# EAGLE design SensorBoard_Mega (EAGLE 7.3.0)
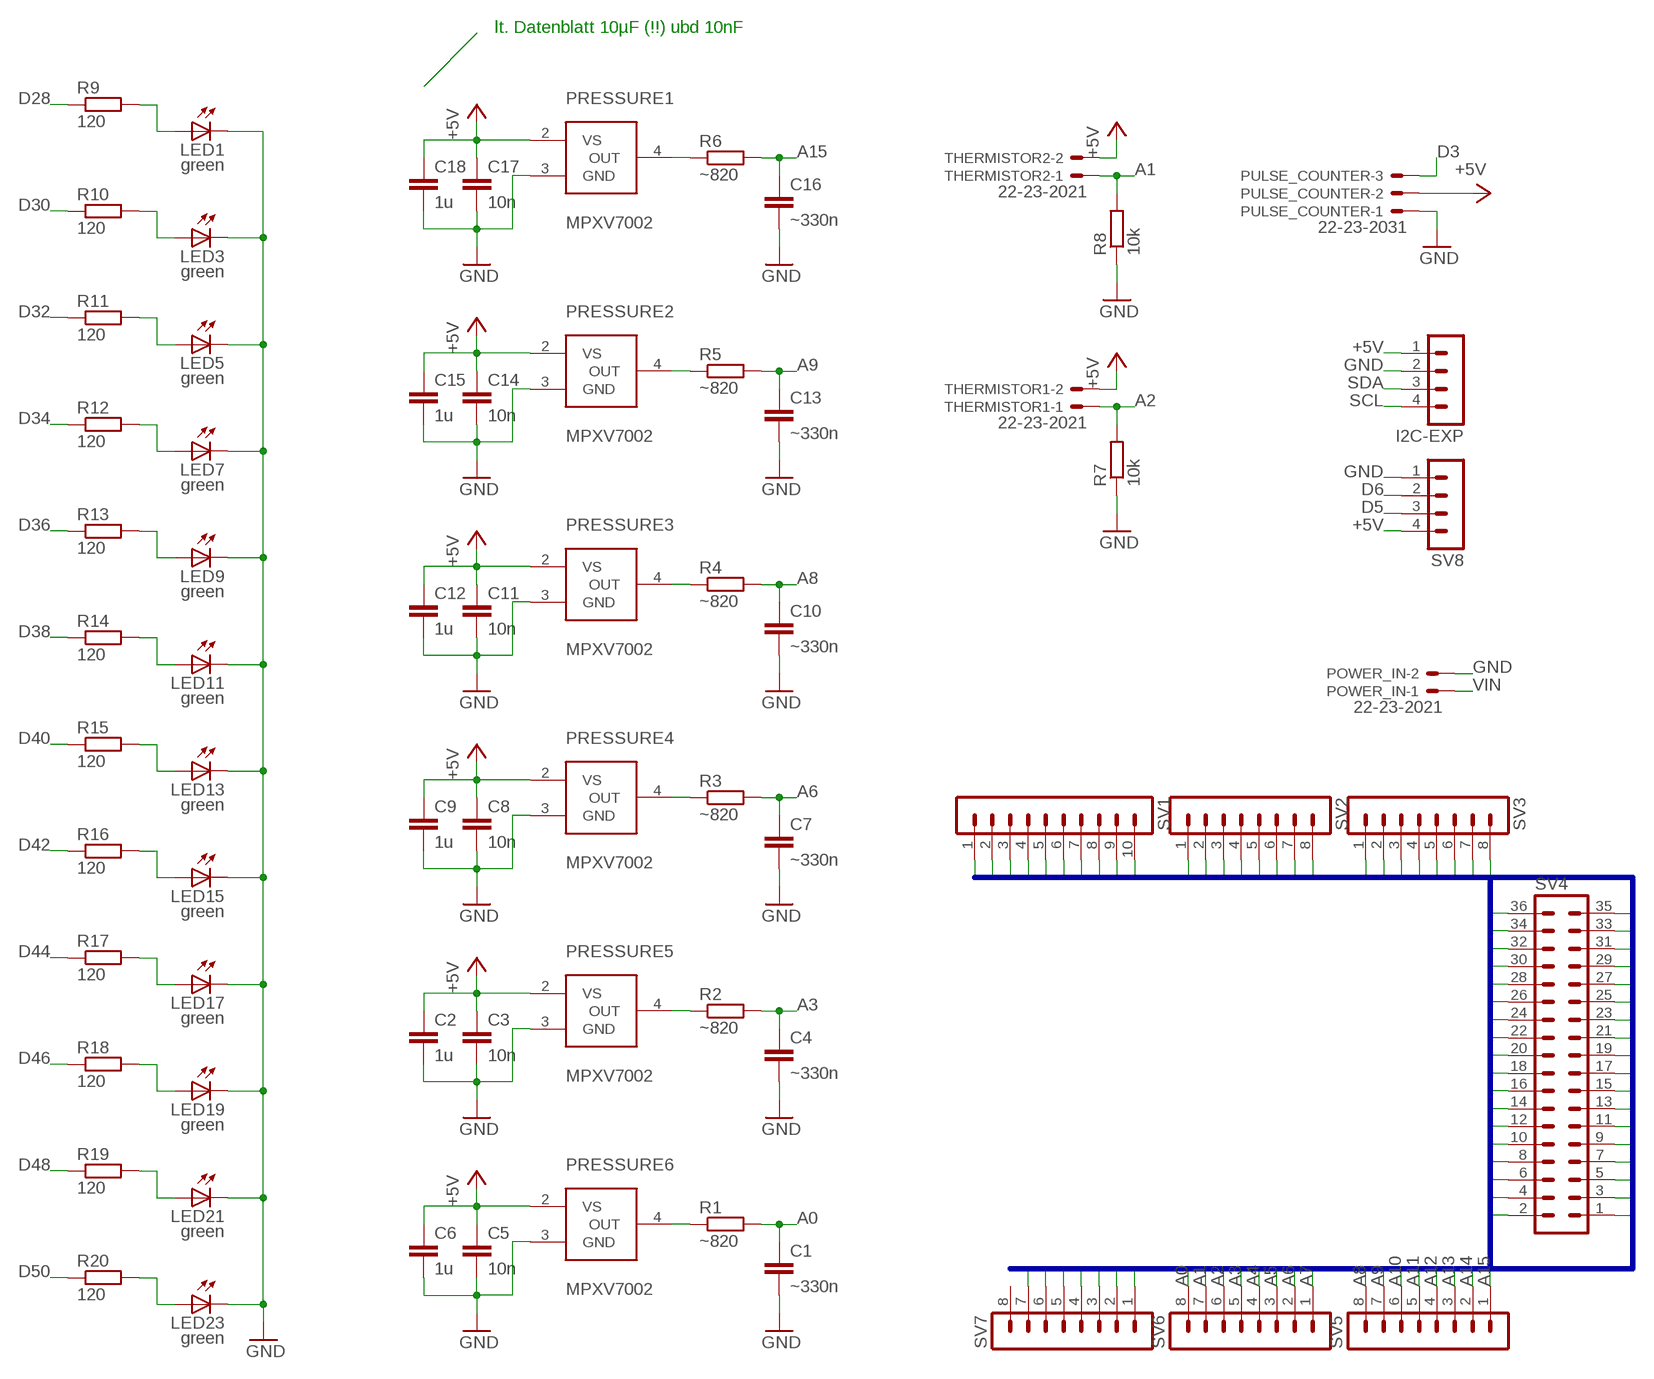
[diagram p0: schematic, sheet 1]

## Parts
C1  ~330n  C-EUC0805  [C0805]
C2  1u  C-EUC0805  [C0805]
C3  10n  C-EUC0805  [C0805]
C4  ~330n  C-EUC0805  [C0805]
C5  10n  C-EUC0805  [C0805]
C6  1u  C-EUC0805  [C0805]
C7  ~330n  C-EUC0805  [C0805]
C8  10n  C-EUC0805  [C0805]
C9  1u  C-EUC0805  [C0805]
C10  ~330n  C-EUC0805  [C0805]
C11  10n  C-EUC0805  [C0805]
C12  1u  C-EUC0805  [C0805]
C13  ~330n  C-EUC0805  [C0805]
C14  10n  C-EUC0805  [C0805]
C15  1u  C-EUC0805  [C0805]
C16  ~330n  C-EUC0805  [C0805]
C17  10n  C-EUC0805  [C0805]
C18  1u  C-EUC0805  [C0805]
I2C-EXP  MA04-1  [MA04-1]
LED1  green  LEDCHIPLED_0805  [CHIPLED_0805]
LED3  green  LEDCHIPLED_0805  [CHIPLED_0805]
LED5  green  LEDCHIPLED_0805  [CHIPLED_0805]
LED7  green  LEDCHIPLED_0805  [CHIPLED_0805]
LED9  green  LEDCHIPLED_0805  [CHIPLED_0805]
LED11  green  LEDCHIPLED_0805  [CHIPLED_0805]
LED13  green  LEDCHIPLED_0805  [CHIPLED_0805]
LED15  green  LEDCHIPLED_0805  [CHIPLED_0805]
LED17  green  LEDCHIPLED_0805  [CHIPLED_0805]
LED19  green  LEDCHIPLED_0805  [CHIPLED_0805]
LED21  green  LEDCHIPLED_0805  [CHIPLED_0805]
LED23  green  LEDCHIPLED_0805  [CHIPLED_0805]
POWER_IN  22-23-2021  [22-23-2021]
PRESSURE1  MPXV7002  [MPXV7002DP]
PRESSURE2  MPXV7002  [MPXV7002DP]
PRESSURE3  MPXV7002  [MPXV7002DP]
PRESSURE4  MPXV7002  [MPXV7002DP]
PRESSURE5  MPXV7002  [MPXV7002DP]
PRESSURE6  MPXV7002  [MPXV7002DP]
PULSE_COUNTER  22-23-2031  [22-23-2031]
R1  ~820  R-EU_R0805  [R0805]
R2  ~820  R-EU_R0805  [R0805]
R3  ~820  R-EU_R0805  [R0805]
R4  ~820  R-EU_R0805  [R0805]
R5  ~820  R-EU_R0805  [R0805]
R6  ~820  R-EU_R0805  [R0805]
R7  10k  R-EU_R0805  [R0805]
R8  10k  R-EU_R0805  [R0805]
R9  120  R-EU_R0805  [R0805]
R10  120  R-EU_R0805  [R0805]
R11  120  R-EU_R0805  [R0805]
R12  120  R-EU_R0805  [R0805]
R13  120  R-EU_R0805  [R0805]
R14  120  R-EU_R0805  [R0805]
R15  120  R-EU_R0805  [R0805]
R16  120  R-EU_R0805  [R0805]
R17  120  R-EU_R0805  [R0805]
R18  120  R-EU_R0805  [R0805]
R19  120  R-EU_R0805  [R0805]
R20  120  R-EU_R0805  [R0805]
SV1  MA10-1  [MA10-1]
SV2  MA08-1  [MA08-1]
SV3  MA08-1  [MA08-1]
SV4  MA18-2  [MA18-2]
SV5  MA08-1  [MA08-1]
SV6  MA08-1  [MA08-1]
SV7  MA08-1  [MA08-1]
SV8  MA04-1  [MA04-1]
THERMISTOR1  22-23-2021  [22-23-2021]
THERMISTOR2  22-23-2021  [22-23-2021]

## Nets
+3V3: SV7.5
+5V: C2.1 C3.1 C5.1 C6.1 C8.1 C9.1 C11.1 C12.1 C14.1 C15.1 C17.1 C18.1 I2C-EXP.1 PRESSURE1.2(VS) PRESSURE2.2(VS) PRESSURE3.2(VS) PRESSURE4.2(VS) PRESSURE5.2(VS) PRESSURE6.2(VS) PULSE_COUNTER.2 SV4.35 SV4.36 SV7.4 SV8.4 THERMISTOR1.2 THERMISTOR2.2
A0: C1.1 R1.2 SV6.8
A1: R8.2 SV6.7 THERMISTOR2.1
A2: R7.2 SV6.6 THERMISTOR1.1
A3: C4.1 R2.2 SV6.5
A4: SV6.4
A5: SV6.3
A6: C7.1 R3.2 SV6.2
A7: SV6.1
A8: C10.1 R4.2 SV5.8
A9: C13.1 R5.2 SV5.7
A10: SV5.6
A11: SV5.5
A12: SV5.4
A13: SV5.3
A14: SV5.2
A15: C16.1 R6.2 SV5.1
AREF: SV1.3
D0: SV2.8
D1: SV2.7
D2: SV2.6
D3: PULSE_COUNTER.3 SV2.5
D4: SV2.4
D5: SV2.3 SV8.3
D6: SV2.2 SV8.2
D7: SV2.1
D8: SV1.10
D9: SV1.9
D10: SV1.8
D11: SV1.7
D12: SV1.6
D13: SV1.5
D14: SV3.1
D15: SV3.2
D16: SV3.3
D17: SV3.4
D18: SV3.5
D19: SV3.6
D22: SV4.34
D23: SV4.33
D24: SV4.32
D25: SV4.31
D26: SV4.30
D27: SV4.29
D28: R9.1 SV4.28
D29: SV4.27
D30: R10.1 SV4.26
D31: SV4.25
D32: R11.1 SV4.24
D33: SV4.23
D34: R12.1 SV4.22
D35: SV4.21
D36: R13.1 SV4.20
D37: SV4.19
D38: R14.1 SV4.18
D39: SV4.17
D40: R15.1 SV4.16
D41: SV4.15
D42: R16.1 SV4.14
D43: SV4.13
D44: R17.1 SV4.12
D45: SV4.11
D46: R18.1 SV4.10
D47: SV4.9
D48: R19.1 SV4.8
D49: SV4.7
D50: R20.1 SV4.6
D51: SV4.5
D52: SV4.4
D53: SV4.3
GND: C1.2 C2.2 C3.2 C4.2 C5.2 C6.2 C7.2 C8.2 C9.2 C10.2 C11.2 C12.2 C13.2 C14.2 C15.2 C16.2 C17.2 C18.2 I2C-EXP.2 LED1.C LED3.C LED5.C LED7.C LED9.C LED11.C LED13.C LED15.C LED17.C LED19.C LED21.C LED23.C POWER_IN.2 PRESSURE1.3(GND) PRESSURE2.3(GND) PRESSURE3.3(GND) PRESSURE4.3(GND) PRESSURE5.3(GND) PRESSURE6.3(GND) PULSE_COUNTER.1 R7.1 R8.1 SV1.4 SV4.1 SV4.2 SV7.2 SV7.3 SV8.1
IOREF: SV7.7
N$1: LED1.A R9.2
N$3: PRESSURE6.4(OUT) R1.1
N$6: PRESSURE5.4(OUT) R2.1
N$7: PRESSURE4.4(OUT) R3.1
N$8: PRESSURE3.4(OUT) R4.1
N$9: PRESSURE2.4(OUT) R5.1
N$10: PRESSURE1.4(OUT) R6.1
N$13: LED3.A R10.2
N$16: LED5.A R11.2
N$19: LED7.A R12.2
N$22: LED9.A R13.2
N$25: LED11.A R14.2
N$28: LED13.A R15.2
N$31: LED15.A R16.2
N$34: LED17.A R17.2
N$37: LED19.A R18.2
N$40: LED21.A R19.2
N$43: LED23.A R20.2
RESET: SV7.6
SCL: I2C-EXP.4 SV1.2 SV3.8
SDA: I2C-EXP.3 SV1.1 SV3.7
VIN: POWER_IN.1 SV7.1
Unconnected: SV7.8

## Buses
D[0..53],A[0..15],SCL,SDA,AREF,GND,+5V,+3V3,VIN,RESET,IOREF

## Notes on the sheet
- lt. Datenblatt 10µF (!!) ubd 10nF

## Library data of the parts
C1-C18 = rcl:C-EU: CAPACITOR, European symbol
I2C-EXP SV8 = con-lstb:MA04-1: PIN HEADER; OC_FARNELL: unknown; OC_NEWARK: unknown
LED1 LED3 LED5 LED7 LED9 LED11 LED13 LED15 LED17 LED19 LED21 LED23 = led:LED: LED OSRAM: - CHIPLED LG R971, LG N971, LY N971, LG Q971, LY Q971, LO R971, LY R971 LH N974, LH R974 LS Q976, LO Q976, LY Q976 LO Q996 - Hyper CHIPLED LW Q18S LB Q993, LB Q99A, LB R99A - SideLED LS A670, LO A670, LY A670, LG A670, LP A670 LB A673, LV A673, LT A673, LW A673 LH A674 LY A675 LS A676, LA A676, LO A676, LY A676, LW A676 LS A679, LY A679, LG A679 - Hyper Micro SIDELED® LS Y876, LA Y876, LO Y876, LY Y876 LT Y87S - SmartLED LW L88C, LW L88S LB L89C, LB L89S, LG L890 LS L89K, LO L89K, LY L89K LS L896, LA L896, LO L896, LY L896 - TOPLED LS T670, LO T670, LY T670, LG T670, LP T670 LSG T670, LSP T670, LSY T670, LOP T670, LYG T670 LG T671, LOG T671, LSG T671 LB T673, LV T673, LT T673, LW T673 LH T674 LS T676, LA T676, LO T676, LY T676, LB T676, LH T676, LSB T676, LW T676 LB T67C, LV T67C, LT T67C, LS T67K, LO T67K, LY T67K, LW E67C LS E67B, LA E67B, LO E67B, LY E67B, LB E67C, LV E67C, LT E67C LW T67C LS T679, LY T679, LG T679 LS T770, LO T770, LY T770, LG T770, LP T770 LB T773, LV T773, LT T773, LW T773 LH T774 LS E675, LA E675, LY E675, LS T675 LS T776, LA T776, LO T776, LY T776, LB T776 LHGB T686 LT T68C, LB T68C - Hyper Mini TOPLED® LB M676 - Mini TOPLED Santana® LG M470 LS M47K, LO M47K, LY M47K Source: http://www.osram.convergy.de LUXEON: - LUMILED® LXK2-PW12-R00, LXK2-PW12-S00, LXK2-PW14-U00, LXK2-PW14-V00 LXK2-PM12-R00, LXK2-PM12-S00, LXK2-PM14-U00 LXK2-PE12-Q00, LXK2-PE12-R00, LXK2-PE12-S00, LXK2-PE14-T00, LXK2-PE14-U00 LXK2-PB12-K00, LXK2-PB12-L00, LXK2-PB12-M00, LXK2-PB14-N00, LXK2-PB14-P00, LXK2-PB14-Q00 LXK2-PR12-L00, LXK2-PR12-M00, LXK2-PR14-Q00, LXK2-PR14-R00 LXK2-PD12-Q00, LXK2-PD12-R00, LXK2-PD12-S00 LXK2-PH12-R00, LXK2-PH12-S00 LXK2-PL12-P00, LXK2-PL12-Q00, LXK2-PL12-R00 Source: www.luxeon.com KINGBRIGHT: KA-3528ASYC Source: www.kingbright.com
POWER_IN THERMISTOR1 THERMISTOR2 = con-molex:22-23-2021: .100" (2.54mm) Center Header - 2 Pin; MF: MOLEX; MPN: 22-23-2021; OC_FARNELL: 1462926; OC_NEWARK: 25C3832
PRESSURE1-PRESSURE6 = pcaroli:MPXV7002
PULSE_COUNTER = con-molex:22-23-2031: .100" (2.54mm) Center Header - 3 Pin; MF: MOLEX; MPN: 22-23-2031; OC_FARNELL: 1462950; OC_NEWARK: 30C0862
R1-R20 = rcl:R-EU_: RESISTOR, European symbol
SV1 = con-lstb-mod:MA10-1: PIN HEADER; OC_FARNELL: unknown; OC_NEWARK: unknown
SV2 SV3 SV5-SV7 = con-lstb-mod:MA08-1: PIN HEADER; OC_FARNELL: unknown; OC_NEWARK: unknown
SV4 = con-lstb-mod:MA18-2: PIN HEADER; OC_FARNELL: unknown; OC_NEWARK: unknown

## Net classes
0 default: clearance 0.205 mm

## Board
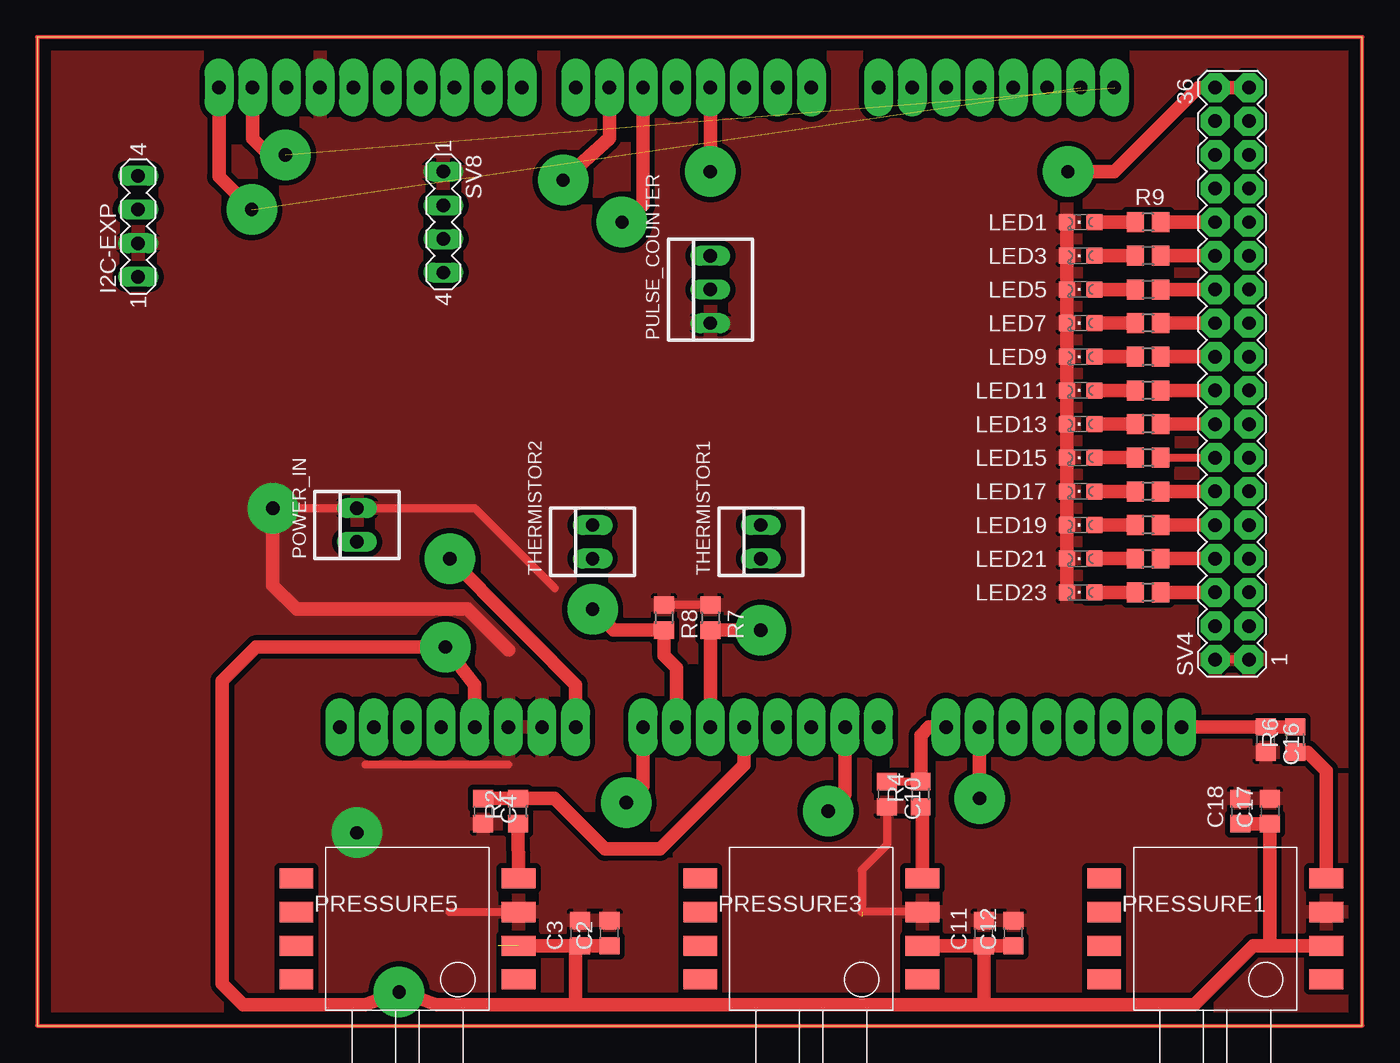
[diagram p1: board, top side]
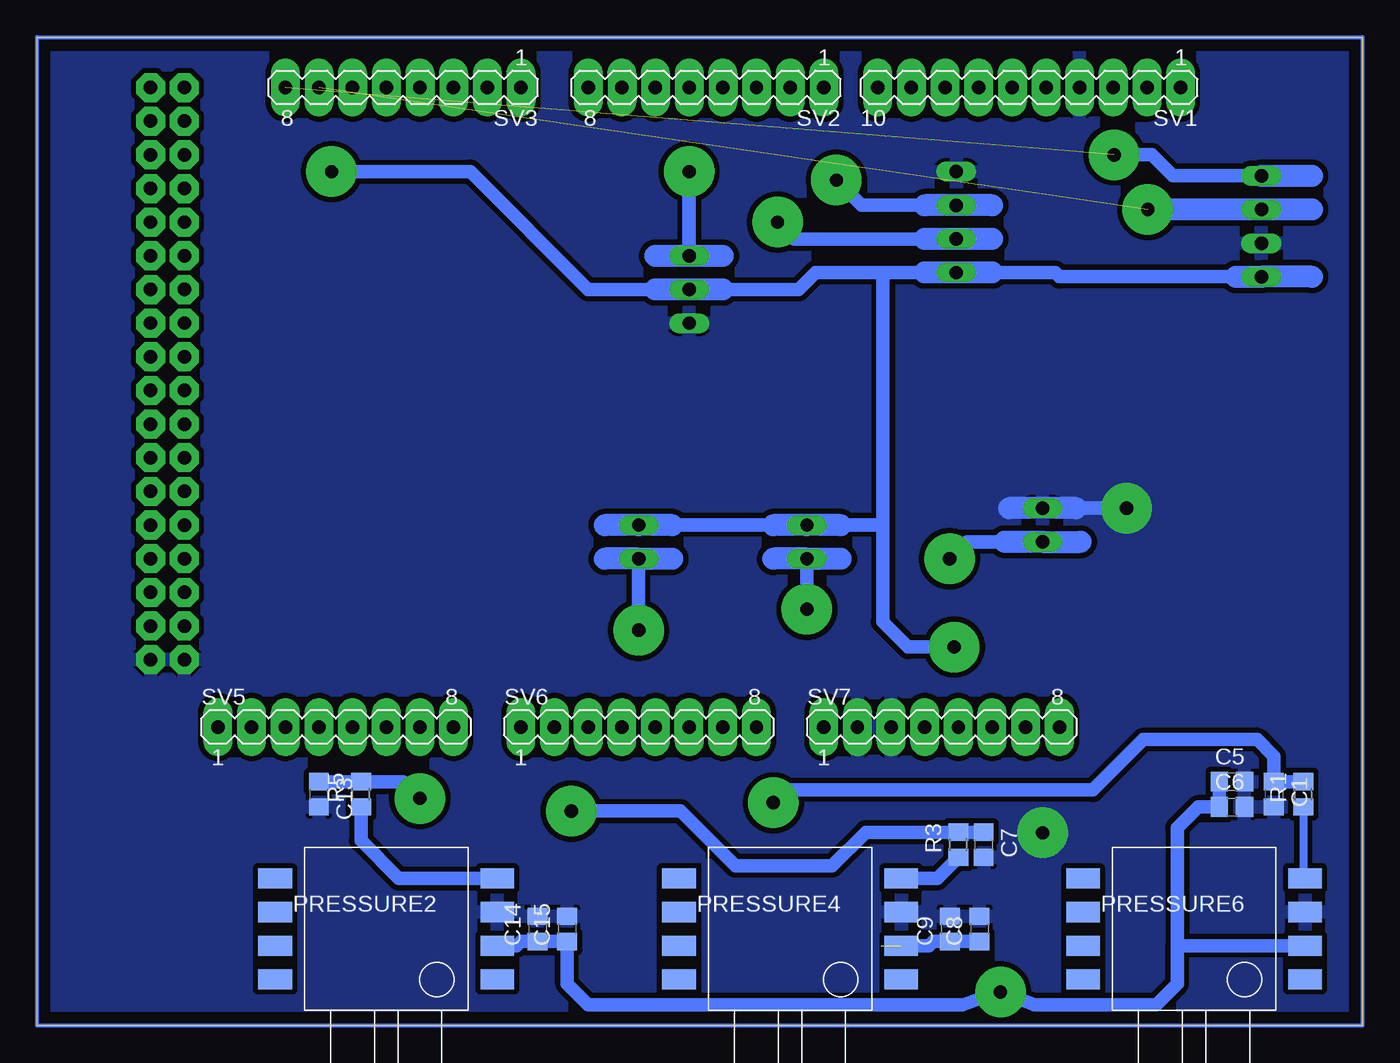
[diagram p2: board, bottom side, seen from below]

Size 100 x 74.6 mm. Coordinates in mm from the lower left corner, seen from the top.
Outline: 0,0 100,0 100,74.6 0,74.6 0,0
Copper layers (1*16): Top 0.035mm / dielectric 1.5mm / Bottom 0.035mm
Design rules "arduinoMega_ralf *": minimum track width 10mil, minimum drill 24mil, track to track 0.205mm, track to pad 0.205mm, pad to pad 0.205mm, via to via 0.205mm, smd to smd 8mil, copper to edge 40mil, drill to drill 8mil, minimum pad ring 10mil, minimum via ring 8mil, stop-mask expansion 4mil, vias tented up to drill 0mil, thermal gap 10mil

### Footprints (pad centres in the part's own frame; a part is rotated, then mirrored left to right if it is on the bottom)
C0805 = smd 1.3 x 1.5: 1 -0.95,0; 2 0.95,0
MA04-1 = drill 1.016 long: 1 -3.81,0; 2 -1.27,0; 3 1.27,0; 4 3.81,0
CHIPLED_0805 = smd 1.2 x 1.2: A 0,-1.05; C 0,1.05
22-23-2021 = drill 1 long: 1 -1.27,0; 2 1.27,0
MPXV7002DP = smd 2.54 x 1.524: 1 -8.382,3.81; 2 -8.382,1.27; 3 -8.382,-1.27; 4 -8.382,-3.81; 5 8.382,-3.81; 6 8.382,-1.27; 7 8.382,1.27; 8 8.382,3.81
22-23-2031 = drill 1 long: 1 -2.54,0; 2 0,0; 3 2.54,0
R0805 = smd 1.3 x 1.5: 1 -0.95,0; 2 0.95,0
MA10-1 = drill 1.016 pad 2.184 long: 1 -11.43,0; 2 -8.89,0; 3 -6.35,0; 4 -3.81,0; 5 -1.27,0; 6 1.27,0; 7 3.81,0; 8 6.35,0; 9 8.89,0; 10 11.43,0
MA08-1 = drill 1.016 pad 2.184 long: 1 -8.89,0; 2 -6.35,0; 3 -3.81,0; 4 -1.27,0; 5 1.27,0; 6 3.81,0; 7 6.35,0; 8 8.89,0
MA18-2 = drill 1.016 pad 2.184 octagon: 1 -21.59,-1.27; 2 -21.59,1.27; 3 -19.05,-1.27; 4 -19.05,1.27; 5 -16.51,-1.27; 6 -16.51,1.27; 7 -13.97,-1.27; 8 -13.97,1.27; 9 -11.43,-1.27; 10 -11.43,1.27; 11 -8.89,-1.27; 12 -8.89,1.27; 13 -6.35,-1.27; 14 -6.35,1.27; 15 -3.81,-1.27; 16 -3.81,1.27; 17 -1.27,-1.27; 18 -1.27,1.27; 19 1.27,-1.27; 20 1.27,1.27; 21 3.81,-1.27; 22 3.81,1.27; 23 6.35,-1.27; 24 6.35,1.27; 25 8.89,-1.27; 26 8.89,1.27; 27 11.43,-1.27; 28 11.43,1.27; 29 13.97,-1.27; 30 13.97,1.27; 31 16.51,-1.27; 32 16.51,1.27; 33 19.05,-1.27; 34 19.05,1.27; 35 21.59,-1.27; 36 21.59,1.27

### Placement (x,y rotation side)
C1  6.67,17.46 270 bottom
C2  43.18,6.99 90 top
C3  40.96,6.99 90 top
C4  33.66,16.19 270 top
C5  9.84,18.41 0 bottom
C6  9.84,16.51 0 bottom
C7  28.57,13.65 270 bottom
C8  28.89,7.3 90 bottom
C9  31.11,7.3 90 bottom
C10  64.14,17.46 270 top
C11  71.44,6.99 90 top
C12  73.66,6.99 90 top
C13  78.74,17.46 270 bottom
C14  62.23,7.3 90 bottom
C15  60.01,7.3 90 bottom
C16  92.71,21.59 270 top
C17  93.03,16.19 90 top
C18  90.81,16.19 90 top
I2C-EXP  7.62,60.33 90 top
LED1  78.74,60.64 90 top
LED3  78.74,58.1 90 top
LED5  78.74,55.56 90 top
LED7  78.74,53.02 90 top
LED9  78.74,50.48 90 top
LED11  78.74,47.94 90 top
LED13  78.74,45.4 90 top
LED15  78.74,42.86 90 top
LED17  78.74,40.32 90 top
LED19  78.74,37.78 90 top
LED21  78.74,35.24 90 top
LED23  78.74,32.7 90 top
POWER_IN  24.13,37.78 90 top
PRESSURE1  88.9,7.3 180 top
PRESSURE2  73.66,7.3 180 bottom
PRESSURE3  58.42,7.3 180 top
PRESSURE4  43.18,7.3 180 bottom
PRESSURE5  27.94,7.3 180 top
PRESSURE6  12.7,7.3 180 bottom
PULSE_COUNTER  50.8,55.56 90 top
R1  4.45,17.46 90 bottom
R2  36.3,16.19 90 top
R3  30.48,13.65 90 bottom
R4  66.67,17.46 90 top
R5  75.56,17.46 90 bottom
R6  94.93,21.59 90 top
R7  50.8,30.8 270 top
R8  47.31,30.8 270 top
R9  83.82,60.64 180 top
R10  83.82,58.1 180 top
R11  83.82,55.56 180 top
R12  83.82,53.02 180 top
R13  83.82,50.48 180 top
R14  83.82,47.94 180 top
R15  83.82,45.4 180 top
R16  83.82,42.86 180 top
R17  83.82,40.32 180 top
R18  83.82,37.78 180 top
R19  83.82,35.24 180 top
R20  83.82,32.7 180 top
SV1  25.15,70.8 180 bottom
SV2  49.53,70.8 180 bottom
SV3  72.39,70.8 180 bottom
SV4  90.17,49.21 90 top
SV5  77.47,22.54 0 bottom
SV6  54.61,22.54 0 bottom
SV7  31.75,22.54 0 bottom
SV8  30.64,60.64 270 top
THERMISTOR1  54.61,36.51 90 top
THERMISTOR2  41.91,36.51 90 top

### Tracks (layer width: path | path; a pad name or v marks a point on that pad's centre or on a via)
+5V  (via drill 1 pad 3.81)  (1 unrouted)
  Top 1.016: SV4.35 SV4.36 87.63,70.8 81.28,64.45 v77.79,64.45 | PRESSURE1.2 93.03,6.03 | 93.03,6.03 91.76,6.03 87.31,1.59 71.44,1.59 | 71.44,1.59 40.64,1.59 | 40.64,1.59 30.16,1.59 v27.3,2.54 24.77,1.59 15.56,1.59 13.97,3.17 13.97,26.04 16.51,28.57 v30.8,28.57 33.02,25.72 SV7.4 33.02,23.18 | PRESSURE5.2 40.64,6.03 | 40.64,6.03 40.64,1.59 | C18.1 C17.1 93.03,6.03 | C2.1 C3.1 40.64,6.04 40.64,6.03 | PRESSURE3.2 71.12,6.03 | C12.1 C11.1 71.12,6.03 | 71.12,6.03 71.44,5.71 71.44,1.59
  Bottom 0.61: 53.34,55.56 PULSE_COUNTER.2 | SV8.4 33.02,56.83
  Bottom 1.016: 44.45,37.78 52.07,37.78 | 9.53,56.52 22.86,56.52 23.18,56.83 28.57,56.83 | 53.34,55.56 58.42,55.56 67.31,64.45 v77.79,64.45 | v30.8,28.57 34.29,28.57 36.2,30.48 36.2,37.78 | 36.2,37.78 39.37,37.78 | 33.02,56.83 35.88,56.83 | 35.88,56.83 41.27,56.83 42.55,55.56 48.26,55.56 | 36.2,37.78 36.2,56.52 arc90 35.88,56.83 | PRESSURE6.2 13.97,6.03 | PRESSURE2.2 63.82,6.03 63.5,6.35 C14.1 C15.1 60.01,3.17 58.42,1.59 30.16,1.59 v27.3,2.54 24.77,1.59 15.56,1.59 13.97,3.17 13.97,6.03 | C8.1 C9.1 32.38,6.35 32.7,6.03 PRESSURE4.2 | 13.97,6.03 13.97,14.92 12.38,16.51 C6.1 C5.1
  Bottom 1.676: 27.94,56.83 28.57,56.83 33.02,56.83 | 48.26,55.56 53.34,55.56 | 39.37,37.78 THERMISTOR2.2 44.45,37.78 | 52.07,37.78 THERMISTOR1.2 57.15,37.78 | 9.53,56.52 I2C-EXP.1 3.81,56.52
A0  (via drill 1 pad 3.81)
  Top 1.016: SV6.8 45.72,18.1 v44.45,16.83
  Bottom 1.016: v44.45,16.83 44.13,16.83 43.18,17.78 20.32,17.78 16.51,21.59 7.94,21.59 6.67,20.32 C1.1 R1.2
A1  (via drill 1 pad 3.81)
  Top 1.016: SV6.7 48.26,26.99 47.31,27.94 R8.2 43.49,29.85 v41.91,31.43
  Bottom 1.016: THERMISTOR2.1 v41.91,31.43
  Bottom 1.676: 39.37,35.24 THERMISTOR2.1 44.45,35.24
A2  (via drill 1 pad 3.81)
  Top 0.61: v54.61,29.85 v54.61,29.84
  Top 1.016: v54.61,29.85 R7.2 SV6.6
  Bottom 1.016: v54.61,29.84 THERMISTOR1.1
  Bottom 1.676: 52.07,35.24 THERMISTOR1.1 57.15,35.24
A3
  Top 1.016: C4.1 R2.2 39.05,17.14 42.86,13.34 46.99,13.34 53.34,19.68 SV6.5
A6  (via drill 1 pad 3.81)
  Top 1.016: SV6.2 60.96,17.46 v59.69,16.19
  Bottom 1.016: C7.1 R3.2 37.47,14.6 40.01,12.06 47.31,12.06 51.44,16.19 v59.69,16.19
A8
  Top 0.61: R4.2 C10.1
  Top 1.016: R4.2 66.67,21.91 67.31,22.54 SV5.8
A9  (via drill 1 pad 3.81)
  Top 1.016: v71.12,17.14 SV5.7
  Bottom 1.016: C13.1 R5.2 72.39,18.41 v71.12,17.14
A15
  Top 1.016: R6.2 C16.1 SV5.1
D3  (via drill 1 pad 3.81)
  Top 1.016: v50.8,64.45 SV2.5
  Bottom 1.016: v50.8,64.45 PULSE_COUNTER.3
  Bottom 1.676: 48.26,58.1 PULSE_COUNTER.3 53.34,58.1
D5  (via drill 1 pad 3.81)
  Top 1.016: v44.13,60.64 45.72,61.91 SV2.3
  Bottom 0.61: SV8.3 33.02,59.37
  Bottom 1.016: 33.02,59.37 42.86,59.37 v44.13,60.64
  Bottom 1.676: 27.94,59.37 33.02,59.37
D6  (via drill 1 pad 3.81)
  Top 1.016: v39.69,63.82 43.18,66.99 SV2.2
  Bottom 0.61: SV8.2 33.02,61.91
  Bottom 1.016: 33.02,61.91 37.78,61.91 v39.69,63.82
  Bottom 1.676: 27.94,61.91 33.02,61.91
D28
  Top 1.016: SV4.28 R9.1
D30
  Top 1.016: SV4.26 R10.1
D32
  Top 1.016: R11.1 SV4.24
D34
  Top 1.016: R12.1 SV4.22
D36
  Top 1.016: R13.1 SV4.20
D38
  Top 1.016: R14.1 SV4.18
D40
  Top 1.016: R15.1 SV4.16
D42
  Top 0.61: R16.1 SV4.14
D44
  Top 1.016: R17.1 SV4.12
D46
  Top 1.016: R18.1 SV4.10
D48
  Top 1.016: R19.1 SV4.8
D50
  Top 1.016: R20.1 SV4.6
GND  (via drill 1 pad 3.81)  (1 unrouted)
  Top 0.61: PRESSURE3.3 62.23,8.57 62.23,11.75 64.14,13.65 C10.2 | 31.11,8.57 PRESSURE5.3 | 35.56,19.68 24.77,19.68 | R7.1 R8.1 | SV4.1 SV4.2 | 39.05,33.02 33.02,39.05 POWER_IN.2 v17.78,39.05
  Top 1.016: LED1.C LED3.C LED5.C LED7.C LED9.C LED11.C LED13.C LED15.C LED17.C LED19.C LED21.C LED23.C | 35.56,28.37 32.49,31.43 19.58,31.43 17.78,33.23 v17.78,39.05
  Bottom 1.016: v17.78,39.05 21.59,39.05 POWER_IN.2
  Bottom 1.676: 21.59,39.05 26.67,39.05
  other vias: 24.13,14.56
  pour Top (isolate 0.4): 0,74.61 101.92,74.61 101.92,0 0,0
  pour Top (isolate 0.4): 0,74.61 0,0 100.97,0 100.97,74.61
  pour Bottom (isolate 0.4): 101.6,74.93 -0.32,74.93 -0.32,0.32 101.6,0.32
  pour Top (no thermals): 12.38,53.66 40.01,53.66 40.32,42.55 20,42.55 19.68,36.83 12.38,36.83
  pour Top (no thermals): 40.01,43.81 58.1,43.5 57.78,39.69 39.37,40.01 39.69,43.5
  pour Top (isolate 0.025, rank 6, no thermals): 33.02,65.72 36.51,65.72 36.51,54.93 33.34,55.24
  pour Top (isolate 0.025, rank 6, no thermals): 45.09,56.83 48.26,56.83 48.26,51.12 53.66,51.12 53.66,58.1 56.52,56.52 56.52,49.85 45.09,49.85
N$1
  Top 1.016: R9.2 LED1.A
N$2
  pour Top (no thermals): 73.98,63.18 76.52,62.23 76.52,30.48 74.93,29.21 70.48,28.57 73.66,63.18
N$3
  Bottom 0.61: R1.1 4.45,11.24 PRESSURE6.4
N$4
  pour Top (no thermals): 22.54,42.86 26.99,42.86 26.99,31.75 22.23,32.07 22.54,34.92 26.35,34.61 26.04,40.64 22.54,40.64
N$5
  pour Top (rank 6, no thermals): 53.66,57.15 53.34,50.8 57.15,57.47 53.98,57.47
N$6
  Top 1.016: PRESSURE5.4 R2.1
N$7
  Bottom 1.016: PRESSURE4.4 32.07,11.11 R3.1
N$8
  Top 0.61: R4.1 66.8,16.51
  Top 1.016: 66.8,16.51 PRESSURE3.4
N$9
  Bottom 1.016: R5.1 75.56,13.97 72.71,11.11 PRESSURE2.4
N$10
  Top 1.016: R6.1 95.88,20.64 97.28,19.24 PRESSURE1.4
N$13
  Top 1.016: R10.2 LED3.A
N$16
  Top 1.016: R11.2 LED5.A
N$19
  Top 1.016: R12.2 LED7.A
N$22
  Top 1.016: R13.2 LED9.A
N$25
  Top 1.016: R14.2 LED11.A
N$28
  Top 1.016: R15.2 LED13.A
N$31
  Top 1.016: R16.2 LED15.A
N$34
  Top 1.016: R17.2 LED17.A
N$37
  Top 1.016: LED19.A R18.2
N$40
  Top 1.016: LED21.A R19.2
N$43
  Top 1.016: LED23.A R20.2
N$86
  Top 0.305: 0,74.6 0,0 100,0 100,74.6 0,74.6
N$87
  Bottom 0.305: 0,74.6 0,0 100,0 100,74.6 0,74.6
SCL  (via drill 1 pad 3.81)  (1 unrouted)
  Top 1.016: SV1.2 16.26,66.93 17.46,65.72 v18.73,65.72
  Bottom 1.016: v18.73,65.72 15.88,65.72 14.29,64.14 3.81,64.14
  Bottom 1.676: I2C-EXP.4 3.81,64.14
SDA  (via drill 1 pad 3.81)  (1 unrouted)
  Top 1.016: SV1.1 13.72,64.07 v16.19,61.59
  Bottom 0.61: I2C-EXP.3 v16.19,61.59
  Bottom 1.676: 3.81,61.59 v16.19,61.59
VIN  (via drill 1 pad 3.81)
  Top 1.016: SV7.1 40.64,25.72 37.15,29.21 35.88,30.52 v31.15,35.24
  Bottom 1.016: v31.15,35.24 31.11,35.24 29.84,36.51 26.99,36.51
  Bottom 1.676: 21.27,36.51 POWER_IN.1 26.99,36.51

### Text on the board
tKeepout: SDA
tRestrict: - / 1 / 2 / + | - + | Lasersaur | SensorShield | V 1.2 | T1 | T2 | - / / / + | 1 / 2 / 3 / 4 / 5 / 6 / 7 / 8 / 9 / 10 / 11 / 12